# EAGLE schematic HW2 (EAGLE 7.2.0)
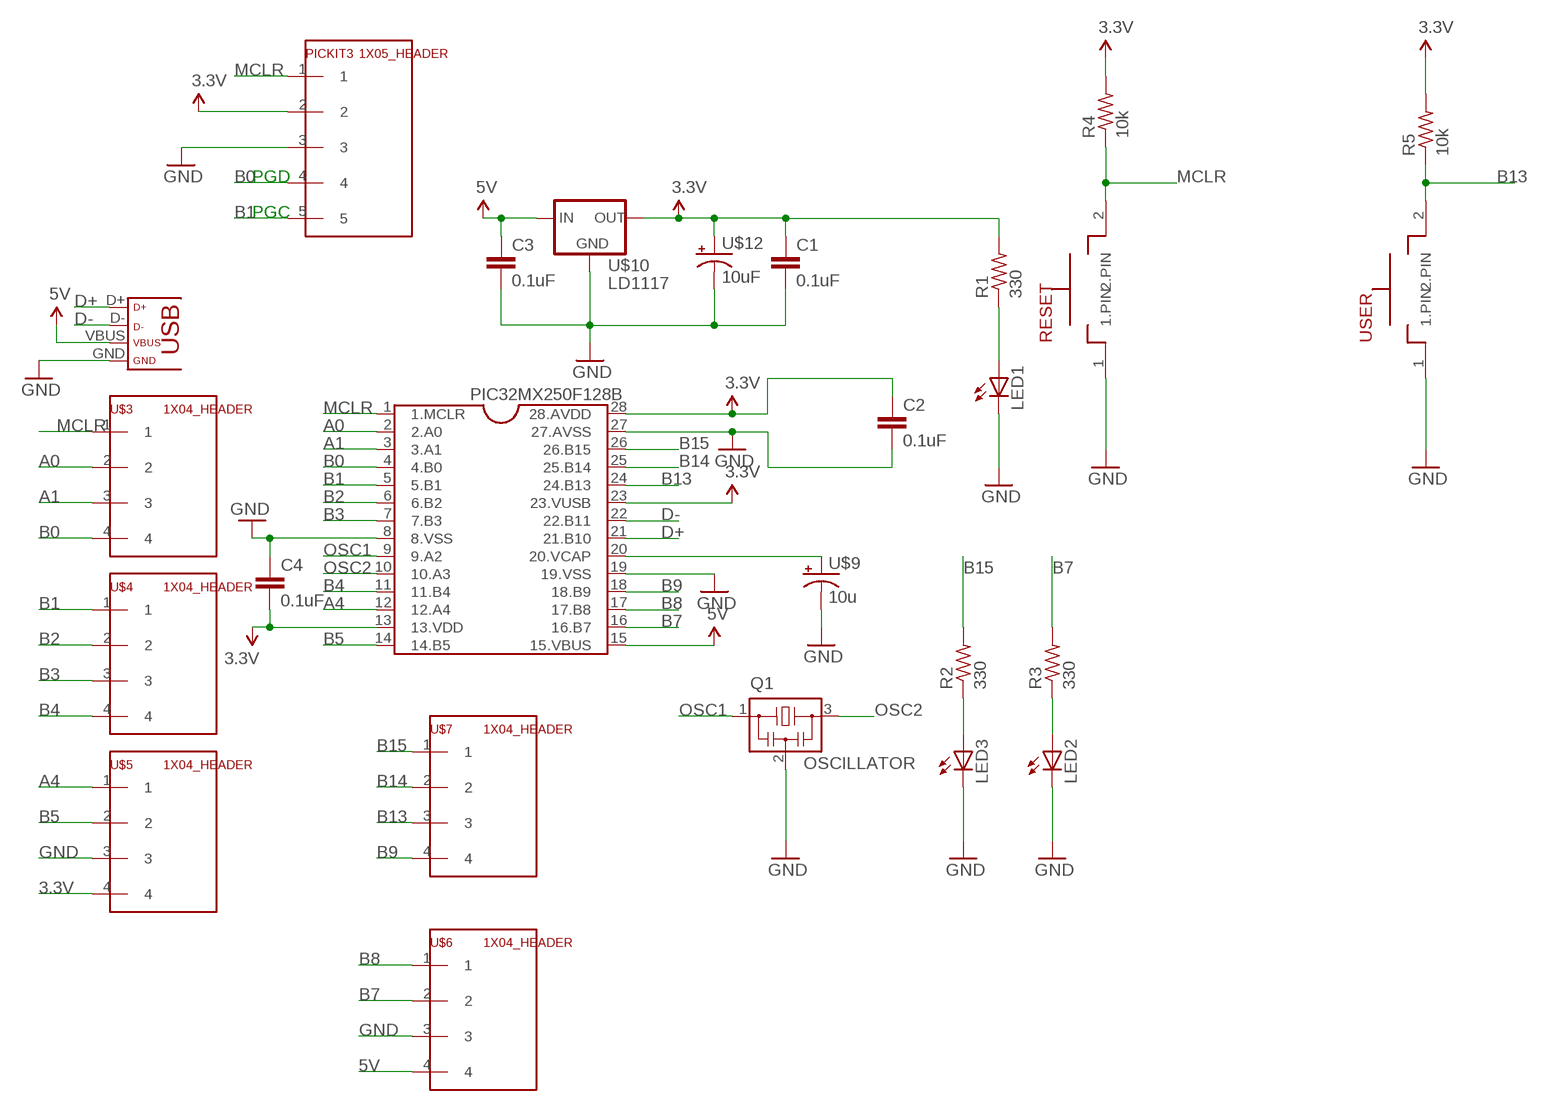
[diagram p0: schematic, sheet 1]

## Parts
C1  0.1uF  C-EU025-024X044  [C025-024X044]
C2  0.1uF  C-EU025-024X044  [C025-024X044]
C3  0.1uF  C-EU025-024X044  [C025-024X044]
C4  0.1uF  C-EU025-024X044  [C025-024X044]
LED1  LED3MM  [LED3MM]
LED2  LED3MM  [LED3MM]
LED3  LED3MM  [LED3MM]
PIC32MX250F128B  DIL28-3  [DIL28-3]
PICKIT3  1X05_HEADER  [1X05]
Q1  OSCILLATOR  CSTCR  [OSC]
R1  330  R-US_0411/12  [0411/12]
R2  330  R-US_0411/12  [0411/12]
R3  330  R-US_0411/12  [0411/12]
R4  10k  R-US_0411/12  [0411/12]
R5  10k  R-US_0411/12  [0411/12]
RESET  BUTTON  [BUTTON]
U$1  USB  [USB-MINIB]
U$3  1X04_HEADER  [1X04]
U$4  1X04_HEADER  [1X04]
U$5  1X04_HEADER  [1X04]
U$6  1X04_HEADER  [1X04]
U$7  1X04_HEADER  [1X04]
U$9  10u  CAP_POL  [CAP_POL_D]
U$10  LD1117  [TO220]
U$12  10uF  CAP_POL  [CAP_POL_D]
USER  BUTTON  [BUTTON]

## Nets
3.3V: C2.1 C4.2 PIC32MX250F128B.13(13.VDD) PIC32MX250F128B.23(23.VUSB) PIC32MX250F128B.28(28.AVDD) PICKIT3.2 R4.2 R5.2 U$5.4
5V: C3.1 PIC32MX250F128B.15(15.VBUS) U$1.VBUS U$6.4 U$10.3(IN)
A0: PIC32MX250F128B.2(2.A0) U$3.2
A1: PIC32MX250F128B.3(3.A1) U$3.3
A4: PIC32MX250F128B.12(12.A4) U$5.1
B0: PIC32MX250F128B.4(4.B0) PICKIT3.4 U$3.4
B1: PIC32MX250F128B.5(5.B1) PICKIT3.5 U$4.1
B2: PIC32MX250F128B.6(6.B2) U$4.2
B3: PIC32MX250F128B.7(7.B3) U$4.3
B4: PIC32MX250F128B.11(11.B4) U$4.4
B5: PIC32MX250F128B.14(14.B5) U$5.2
B7: PIC32MX250F128B.16(16.B7) R3.2 U$6.2
B8: PIC32MX250F128B.17(17.B8) U$6.1
B9: PIC32MX250F128B.18(18.B9) U$7.4
B13: PIC32MX250F128B.24(24.B13) R5.1 U$7.3 USER.2(2.PIN)
B14: PIC32MX250F128B.25(25.B14) U$7.2
B15: PIC32MX250F128B.26(26.B15) R2.2 U$7.1
D+: PIC32MX250F128B.21(21.B10) U$1.D+
D-: PIC32MX250F128B.22(22.B11) U$1.D-
GND: C1.2 C2.2 C3.2 C4.1 LED1.K(C) LED2.K(C) LED3.K(C) PIC32MX250F128B.8(8.VSS) PIC32MX250F128B.19(19.VSS) PIC32MX250F128B.27(27.AVSS) PICKIT3.3 Q1.2 RESET.1(1.PIN) U$1.GND U$5.3 U$6.3 U$9.2(-) U$10.1(GND) U$12.2(-) USER.1(1.PIN)
MCLR: PIC32MX250F128B.1(1.MCLR) PICKIT3.1 R4.1 RESET.2(2.PIN) U$3.1
N$1: PIC32MX250F128B.20(20.VCAP) U$9.1(+)
N$3: C1.1 R1.2 U$10.2(OUT) U$12.1(+) ; supply symbol labelled 3.3V
N$4: LED1.A R1.1
N$5: LED3.A R2.1
N$6: LED2.A R3.1
OSC1: PIC32MX250F128B.9(9.A2) Q1.1
OSC2: PIC32MX250F128B.10(10.A3) Q1.3

## Notes on the sheet
- PGD
- PGC

## Library data of the parts
C1-C4 = ME433:C-EU: CAPACITOR, European symbol
LED1-LED3 = led:LED: LED OSRAM: - CHIPLED LG R971, LG N971, LY N971, LG Q971, LY Q971, LO R971, LY R971 LH N974, LH R974 LS Q976, LO Q976, LY Q976 LO Q996 - Hyper CHIPLED LW Q18S LB Q993, LB Q99A, LB R99A - SideLED LS A670, LO A670, LY A670, LG A670, LP A670 LB A673, LV A673, LT A673, LW A673 LH A674 LY A675 LS A676, LA A676, LO A676, LY A676, LW A676 LS A679, LY A679, LG A679 - Hyper Micro SIDELED® LS Y876, LA Y876, LO Y876, LY Y876 LT Y87S - SmartLED LW L88C, LW L88S LB L89C, LB L89S, LG L890 LS L89K, LO L89K, LY L89K LS L896, LA L896, LO L896, LY L896 - TOPLED LS T670, LO T670, LY T670, LG T670, LP T670 LSG T670, LSP T670, LSY T670, LOP T670, LYG T670 LG T671, LOG T671, LSG T671 LB T673, LV T673, LT T673, LW T673 LH T674 LS T676, LA T676, LO T676, LY T676, LB T676, LH T676, LSB T676, LW T676 LB T67C, LV T67C, LT T67C, LS T67K, LO T67K, LY T67K, LW E67C LS E67B, LA E67B, LO E67B, LY E67B, LB E67C, LV E67C, LT E67C LW T67C LS T679, LY T679, LG T679 LS T770, LO T770, LY T770, LG T770, LP T770 LB T773, LV T773, LT T773, LW T773 LH T774 LS E675, LA E675, LY E675, LS T675 LS T776, LA T776, LO T776, LY T776, LB T776 LHGB T686 LT T68C, LB T68C - Hyper Mini TOPLED® LB M676 - Mini TOPLED Santana® LG M470 LS M47K, LO M47K, LY M47K Source: http://www.osram.convergy.de LUXEON: - LUMILED® LXK2-PW12-R00, LXK2-PW12-S00, LXK2-PW14-U00, LXK2-PW14-V00 LXK2-PM12-R00, LXK2-PM12-S00, LXK2-PM14-U00 LXK2-PE12-Q00, LXK2-PE12-R00, LXK2-PE12-S00, LXK2-PE14-T00, LXK2-PE14-U00 LXK2-PB12-K00, LXK2-PB12-L00, LXK2-PB12-M00, LXK2-PB14-N00, LXK2-PB14-P00, LXK2-PB14-Q00 LXK2-PR12-L00, LXK2-PR12-M00, LXK2-PR14-Q00, LXK2-PR14-R00 LXK2-PD12-Q00, LXK2-PD12-R00, LXK2-PD12-S00 LXK2-PH12-R00, LXK2-PH12-S00 LXK2-PL12-P00, LXK2-PL12-Q00, LXK2-PL12-R00 Source: www.luxeon.com KINGBRIGHT: KA-3528ASYC Source: www.kingbright.com
PIC32MX250F128B = ME433:DIL28: Dual In Line
PICKIT3 = ME433:1X05_HEADER
Q1 = ME433:CSTCR: Resonator Source: murata.co.jp
R1-R5 = resistor:R-US_: RESISTOR, American symbol
RESET USER = ME433:BUTTON
U$1 = ME433:USB
U$3-U$7 = ME433:1X04_HEADER
U$9 U$12 = ME433:CAP_POL
U$10 = ME433:LD1117